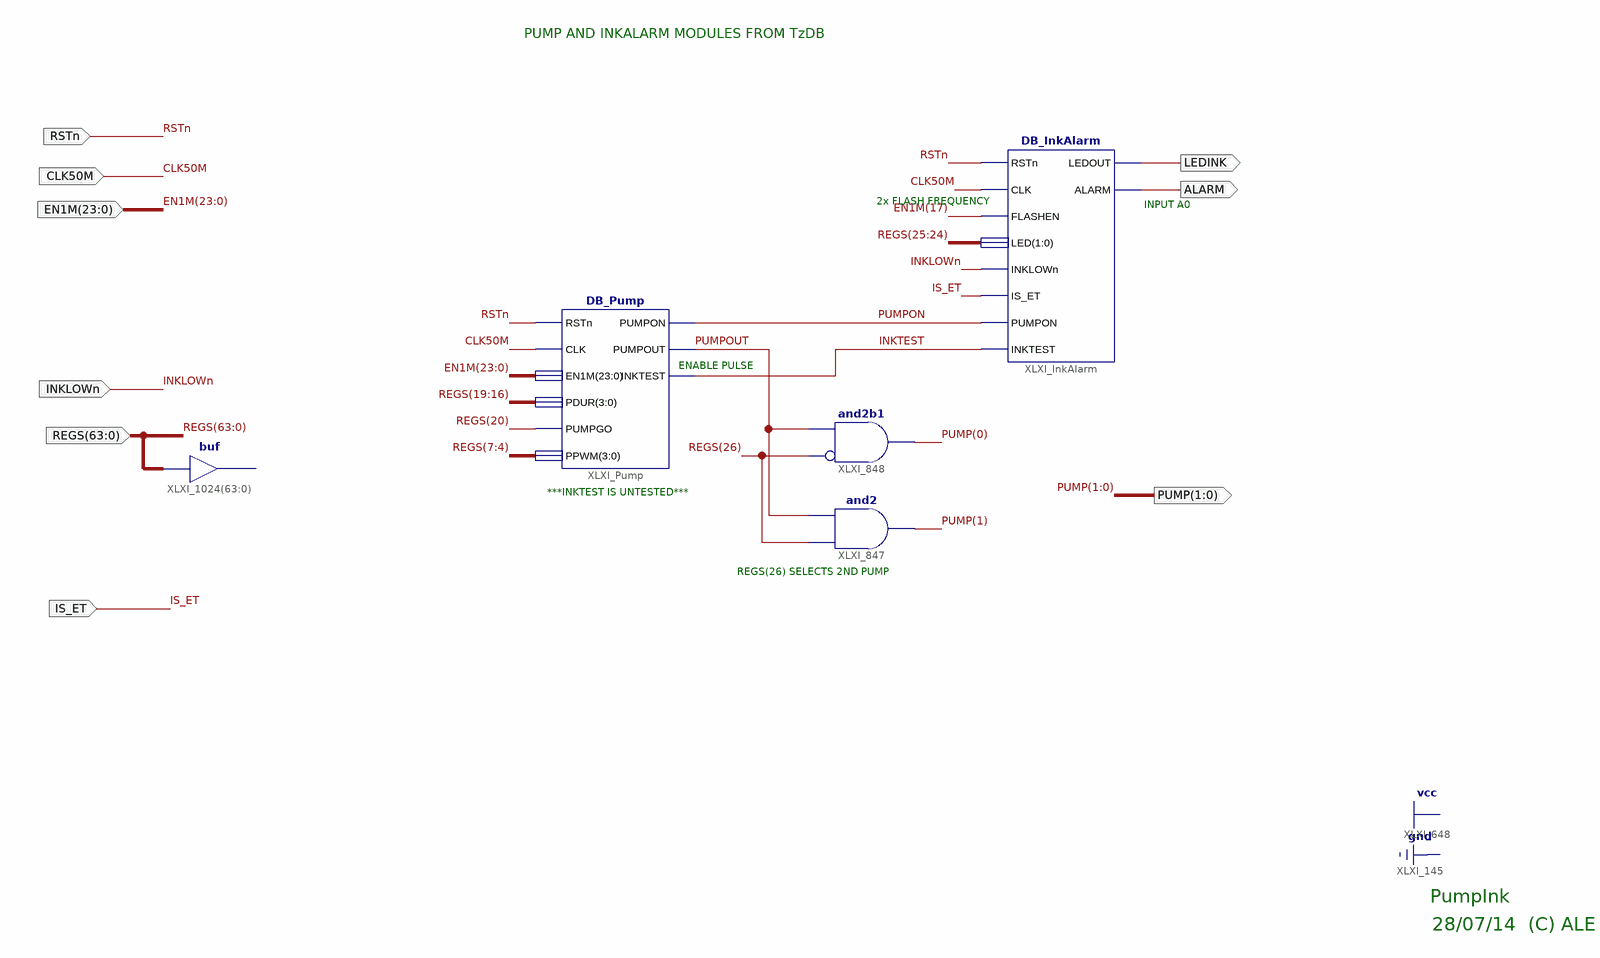
[diagram p0: schematic sheet 1]
// Xilinx ISE schematic DB_PumpInk.sch (spartan3e) as structural Verilog: 5 symbols, 9 ports
module DB_PumpInk (
  input  RSTn,
  input  CLK50M,
  input  INKLOWn,
  input  [63:0] REGS,
  input  [23:0] EN1M,
  input  IS_ET,
  output [1:0] PUMP,
  output ALARM,
  output LEDINK
);

  wire INKTEST, PUMPON, PUMPOUT;

  and XLXI_848 (PUMP[0], ~REGS[26], PUMPOUT);  // and2b1
  // buf XLXI_1024[63..0] has open pins: I=REGS, O=open
  and XLXI_847 (PUMP[1], REGS[26], PUMPOUT);
  DB_Pump XLXI_Pump (
    .CLK(CLK50M), .EN1M(EN1M), .INKTEST(INKTEST), .PDUR(REGS[19:16]), .PPWM(REGS[7:4]), .PUMPGO(REGS[20]),
    .PUMPON(PUMPON), .PUMPOUT(PUMPOUT), .RSTn(RSTn));
  DB_InkAlarm XLXI_InkAlarm (
    .ALARM(ALARM), .CLK(CLK50M), .FLASHEN(EN1M[17]), .INKLOWn(INKLOWn), .INKTEST(INKTEST), .IS_ET(IS_ET),
    .LED(REGS[25:24]), .LEDOUT(LEDINK), .PUMPON(PUMPON), .RSTn(RSTn));

  // Notes on the sheet:
  //   PUMP AND INKALARM MODULES FROM TzDB
  //   2x FLASH FREQUENCY
  //   INPUT A0
  //   ENABLE PULSE
  //   ***INKTEST IS UNTESTED***
  //   REGS(26) SELECTS 2ND PUMP
  //   PumpInk
  //   28/07/14  (C) ALE
endmodule
